# EAGLE design Arduino-Convert (EAGLE 5.10)
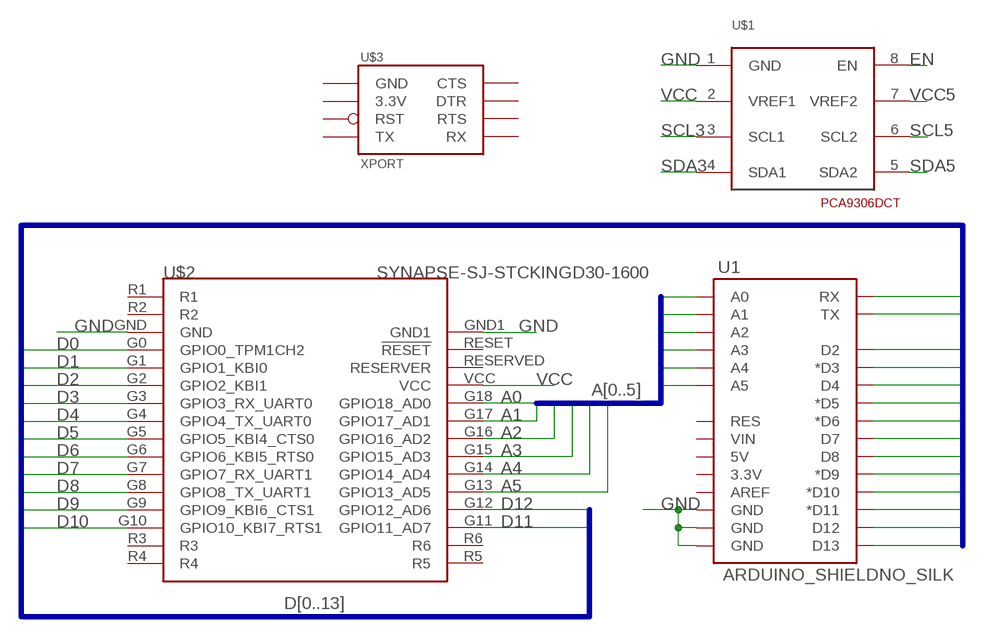
[diagram p0: schematic, sheet 1]

## Parts
U1  ARDUINO_SHIELDNO_SILK  [DUEMILANOVE_VIAS]
U$1  PCA9306DCT  [DCT]
U$2  SYNAPSE-SJ-STCKINGD30-1600  [SYNSJ-STACK]
U$3  XPORT  [XPORT]

## Nets
A0: U1.A0 U$2.G18(GPIO18_AD0)
A1: U1.A1 U$2.G17(GPIO17_AD1)
A2: U1.A2 U$2.G16(GPIO16_AD2)
A3: U1.A3 U$2.G15(GPIO15_AD3)
A4: U1.A4 U$2.G14(GPIO14_AD4)
A5: U1.A5 U$2.G13(GPIO13_AD5)
D0: U1.RX U$2.G0(GPIO0_TPM1CH2)
D1: U1.TX U$2.G1(GPIO1_KBI0)
D2: U1.D2 U$2.G2(GPIO2_KBI1)
D3: U1.D3(*D3) U$2.G3(GPIO3_RX_UART0)
D4: U1.D4 U$2.G4(GPIO4_TX_UART0)
D5: U1.D5(*D5) U$2.G5(GPIO5_KBI4_CTS0)
D6: U1.D6(*D6) U$2.G6(GPIO6_KBI5_RTS0)
D7: U1.D7 U$2.G7(GPIO7_RX_UART1)
D8: U1.D8 U$2.G8(GPIO8_TX_UART1)
D9: U1.D9(*D9) U$2.G9(GPIO9_KBI6_CTS1)
D10: U1.D10(*D10) U$2.G10(GPIO10_KBI7_RTS1)
D11: U1.D11(*D11) U$2.G11(GPIO11_AD7)
D12: U1.D12 U$2.G12(GPIO12_AD6)
D13: U1.D13
EN: U$1.8(EN)
GND: U1.GND@0(GND) U1.GND@1(GND) U1.GND@2(GND) U$1.1(GND) U$2.GND U$2.GND1
SCL3: U$1.3(SCL1)
SCL5: U$1.6(SCL2)
SDA3: U$1.4(SDA1)
SDA5: U$1.5(SDA2)
VCC: U$1.2(VREF1) U$2.VCC
VCC5: U$1.7(VREF2)
Unconnected: U1.3.3V U1.5V U1.AREF U1.RES U1.VIN U$2.R1 U$2.R2 U$2.R3 U$2.R4 U$2.R5 U$2.R6 U$2.RESERVED(RESERVER) U$2.RESET(!RESET) U$3.P1(GND) U$3.P2(3.3V) U$3.P3(RST) U$3.P4(TX) U$3.P5(RX) U$3.P6(RTS) U$3.P7(DTR) U$3.P8(CTS)

## Buses
A[0..5]
D[0..13]

## Library data of the parts
U1 = SparkFun:ARDUINO_SHIELD
U$1 = 0_jc-custom:PCA9306
U$2 = 0_jc-custom:SYNAPSE-SJ-STCKING: Standard layout for expansion modules using Synapse Wireless boards
U$3 = SparkFun:XPORT

## Board
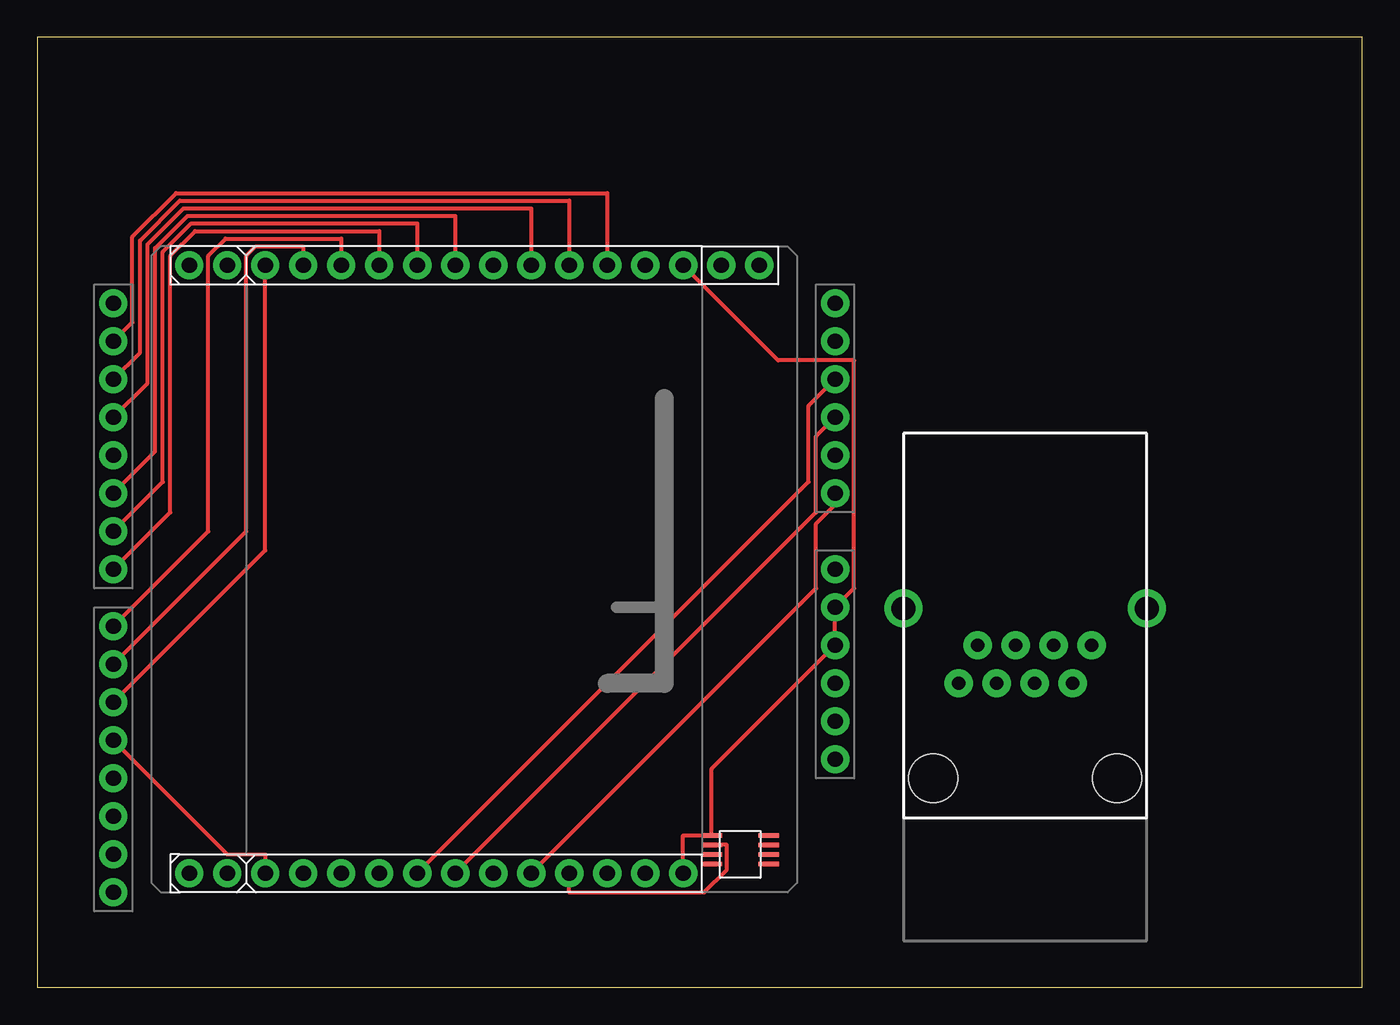
[diagram p1: board, top side]
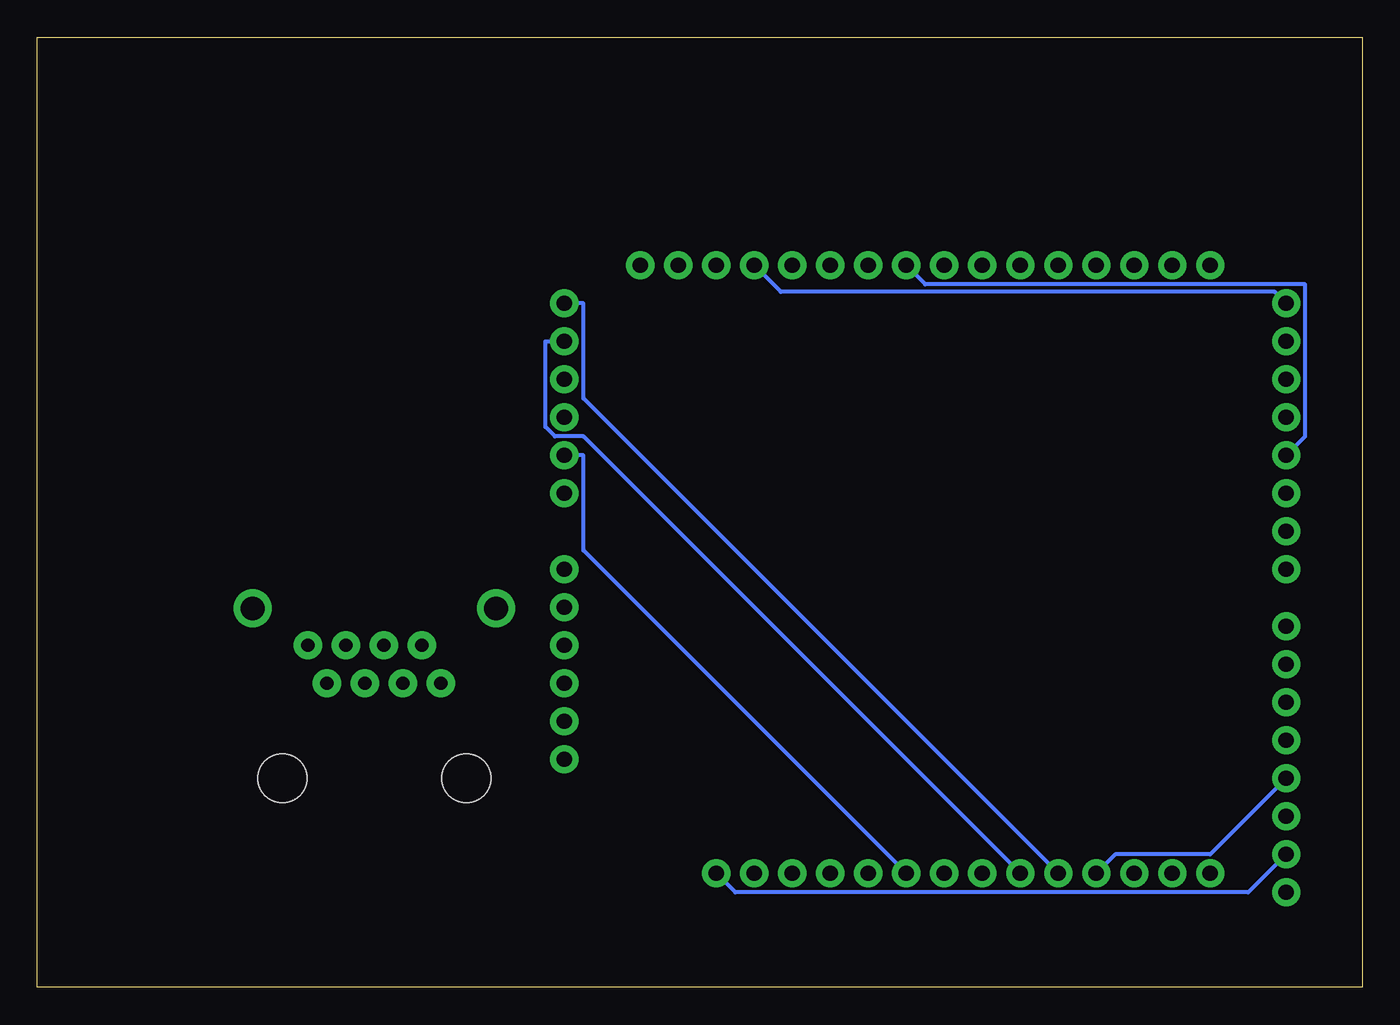
[diagram p2: board, bottom side, seen from below]

Size 88.57 x 63.49 mm. Coordinates in mm from the lower left corner, seen from the top.
Outline: 0,0 88.57,0 88.57,63.49 0,63.49 0,0
Copper layers (1*16): Top 0.035mm / dielectric 1.5mm / Bottom 0.035mm
Design rules "default": minimum track width 10mil, minimum drill 24mil, track to track 8mil, track to pad 8mil, pad to pad 8mil, via to via 8mil, smd to smd 8mil, copper to edge 40mil, drill to drill 8mil, minimum pad ring 10mil, minimum via ring 8mil, stop-mask expansion 4mil, vias tented up to drill 0mil, thermal gap 10mil

### Footprints (pad centres in the part's own frame; a part is rotated, then mirrored left to right if it is on the bottom)
DUEMILANOVE_VIAS = drill 1.016 pad 1.88 round: 3.3V 50.8,13.97; 5V 50.8,16.51; A0 50.8,29.21; A1 50.8,31.75; A2 50.8,34.29; A3 50.8,36.83; A4 50.8,39.37; A5 50.8,41.91; AREF 2.54,2.54; D2 2.54,36.83; D3 2.54,34.29; D4 2.54,31.75; D5 2.54,29.21; D6 2.54,26.67; D7 2.54,24.13; D8 2.54,20.32; D9 2.54,17.78; D10 2.54,15.24; D11 2.54,12.7; D12 2.54,10.16; D13 2.54,7.62; GND@0 50.8,19.05; GND@1 50.8,21.59; GND@2 2.54,5.08; RES 50.8,11.43; RX 2.54,41.91; TX 2.54,39.37; VIN 50.8,24.13
DCT = smd 0.3 x 1.35: 1 -1.27,-1.905; 2 -0.635,-1.905; 3 0,-1.905; 4 0.635,-1.905; 5 0.635,1.905; 6 0,1.905; 7 -0.635,1.905; 8 -1.27,1.905
SYNSJ-STACK = drill 1.016 pad 1.88 round: G0 0,-7.62; G1 0,-10.16; G2 0,-12.7; G3 0,-15.24; G4 0,-17.78; G5 0,-20.32; G6 0,-22.86; G7 0,-25.4; G8 0,-27.94; G9 0,-30.48; G10 0,-33.02; G11 40.64,-33.02; G12 40.64,-30.48; G13 40.64,-27.94; G14 40.64,-25.4; G15 40.64,-22.86; G16 40.64,-20.32; G17 40.64,-17.78; G18 40.64,-15.24; GND 0,-5.08; GND1 40.64,-5.08; R1 0,0; R2 0,-2.54; R3 0,-35.56; R4 0,-38.1; R5 40.64,-38.1; R6 40.64,-35.56; RESERVED 40.64,-10.16; RESET 40.64,-7.62; VCC 40.64,-12.7
XPORT = drill 0.889 pad 1.88 round: 1 -3.175,7.62; 8 4.445,7.62; 10 -4.445,5.08; P1 4.445,7.62; P2 3.175,5.08; P3 1.905,7.62; P4 0.635,5.08; P5 -0.635,7.62; P6 -1.905,5.08; P7 -3.175,7.62; P8 -4.445,5.08 | drill 1.6 pad 2.54 round: GND@9 -8.128,10.081; GND@10 8.128,10.081 | hole 3.251: -6.147,-1.27; 6.147,-1.27

### Placement (x,y rotation side)
U1  2.54,3.81 0 top
U$1  46.99,8.89 270 top
U$2  48.26,48.26 270 top
U$3  66.04,15.24 0 top

### Tracks (layer width: path | path; a pad name or v marks a point on that pad's centre or on a via)
A0
  Top 0.254: U$2.G18 52.07,26.67 52.07,30.99 53.34,32.26 U1.A0
A1
  Bottom 0.254: U$2.G17 52.07,29.21 52.07,35.56 U1.A1
A2
  Top 0.254: U$2.G16 52.07,31.75 52.07,36.83 U1.A2
A3
  Top 0.254: U$2.G15 51.56,33.78 51.56,38.86 U1.A3
A4
  Bottom 0.254: U$2.G14 52.07,36.83 53.98,36.83 54.61,37.47 54.61,43.18 U1.A4
A5
  Bottom 0.254: U$2.G13 52.07,39.37 52.07,45.72 U1.A5
D0
  Bottom 0.254: U1.RX 5.84,46.48 38.86,46.48 U$2.G0
D1
  Top 0.254: U1.TX 6.35,44.45 6.35,50.16 9.27,53.09 38.1,53.09 U$2.G1
D2
  Top 0.254: U1.D2 6.86,42.42 6.86,49.91 9.53,52.58 35.56,52.58 U$2.G2
D3
  Top 0.254: U1.D3 7.37,40.39 7.37,49.66 9.78,52.07 33.02,52.07 U$2.G3
D4
  Bottom 0.254: U1.D4 3.81,36.83 3.81,46.99 29.21,46.99 U$2.G4
D5
  Top 0.254: U1.D5 7.87,35.81 7.87,49.4 10.03,51.56 27.94,51.56 U$2.G5
D6
  Top 0.254: U1.D6 8.38,33.78 8.38,49.15 10.29,51.05 25.4,51.05 U$2.G6
D7
  Top 0.254: U1.D7 8.89,31.75 8.89,48.9 10.54,50.55 22.86,50.55 U$2.G7
D8
  Top 0.254: U1.D8 11.43,30.48 11.43,48.9 12.57,50.04 20.32,50.04 U$2.G8
D9
  Top 0.254: U1.D9 13.97,30.48 13.97,48.9 14.61,49.53 17.78,49.53 U$2.G9
D10
  Top 0.254: U1.D10 15.24,29.21 U$2.G10
D11
  Top 0.254: U1.D11 12.7,8.89 15.24,8.89 U$2.G11
D12
  Bottom 0.254: U1.D12 10.16,8.89 16.51,8.89 U$2.G12
GND
  Top 0.254: U$2.GND 49.53,41.91 54.61,41.91 54.61,26.67 U1.GND@1 U1.GND@0 45.09,14.61 U$1.1 43.18,10.16 U$2.GND1
  Bottom 0.254: U1.GND@2 7.62,6.35 41.91,6.35 U$2.GND1
VCC
  Top 0.254: U$1.2 46.1,9.53 46.1,7.87 44.58,6.35 35.56,6.35 U$2.VCC